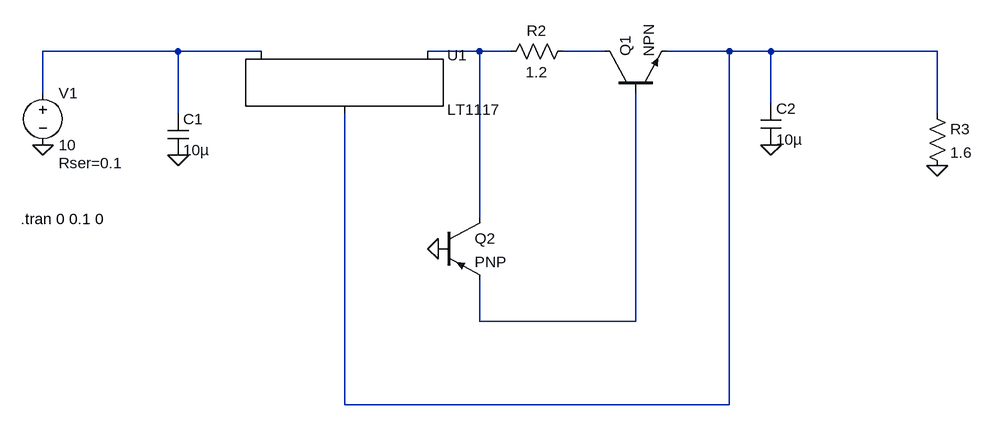
[diagram p0: schematic Draft4.asc]
Draft4.asc, the LTspice schematic file:
Version 4
SHEET 1 1212 872
WIRE -16 176 -224 176
WIRE 112 176 -16 176
WIRE 448 176 368 176
WIRE 496 176 448 176
WIRE 640 176 576 176
WIRE 832 176 736 176
WIRE 896 176 832 176
WIRE 1152 176 896 176
WIRE -224 240 -224 176
WIRE 896 256 896 176
WIRE -16 272 -16 176
WIRE 1152 272 1152 176
WIRE 448 432 448 176
WIRE 448 592 448 528
WIRE 688 592 688 240
WIRE 688 592 448 592
WIRE 240 720 240 272
WIRE 832 720 832 176
WIRE 832 720 240 720
FLAG -224 320 0
FLAG -16 336 0
FLAG 896 320 0
FLAG 1152 352 0
FLAG 384 480 0
SYMBOL res 592 160 R90
WINDOW 0 0 56 VBottom 2
WINDOW 3 32 56 VTop 2
SYMATTR InstName R2
SYMATTR Value 1.2
SYMBOL cap -32 272 R0
SYMATTR InstName C1
SYMATTR Value 10µ
SYMBOL cap 880 256 R0
SYMATTR InstName C2
SYMATTR Value 10µ
SYMBOL res 1136 256 R0
SYMATTR InstName R3
SYMATTR Value 1.6
SYMBOL voltage -224 224 R0
WINDOW 123 0 0 Left 0
WINDOW 39 24 124 Left 2
SYMATTR InstName V1
SYMATTR Value 10
SYMATTR SpiceLine Rser=0.1
SYMBOL PowerProducts\\LT1117 240 176 R0
SYMATTR InstName U1
SYMBOL npn 640 240 R270
SYMATTR InstName Q1
SYMBOL pnp 384 432 R0
SYMATTR InstName Q2
TEXT -258 434 Left 2 !.tran 0 0.1 0

The netlist it stands for:
* Draft4.asc
R2 N003 N002 1.2
C1 N001 0 10µ
C2 N004 0 10µ
R3 N004 0 1.6
V1 N001 0 10 Rser=0.1
XU1 N004 N002 N001 LT1117
Q1 N003 N005 N004 0 NPN
Q2 N002 0 N005 0 PNP
.model NPN NPN
.model PNP PNP
.lib standard.bjt
.tran 0 0.1 0
.lib LT1117.lib
.backanno
.end